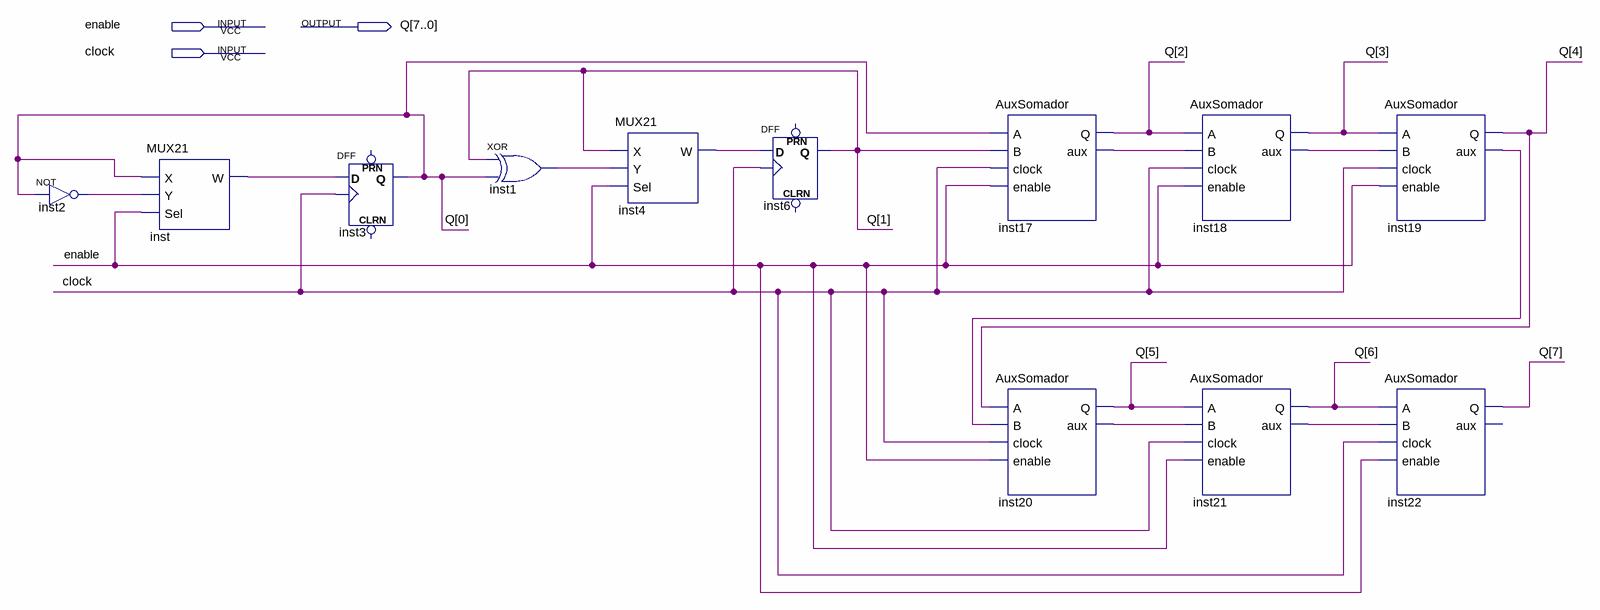
[diagram p0: schematic sheet]
// Quartus schematic Somador.bdf as structural Verilog: 12 symbols, 3 pins
module Somador (
  input  enable,
  input  clock,
  output [7:0] Q
);

  wire inst1_out, inst2_out, inst4_w, inst17_aux, inst18_aux, inst19_aux, inst20_aux, inst21_aux, inst_w;

  not inst2 (inst2_out, Q[0]);
  MUX21 inst (.X(Q[0]), .Y(inst2_out), .Sel(enable), .W(inst_w));
  DFF inst3 (.CLK(clock), .D(inst_w), .Q(Q[0]));  // open: CLRN, PRN
  xor inst1 (inst1_out, Q[1], Q[0]);
  MUX21 inst4 (.X(Q[1]), .Y(inst1_out), .Sel(enable), .W(inst4_w));
  DFF inst6 (.CLK(clock), .D(inst4_w), .Q(Q[1]));  // open: CLRN, PRN
  AuxSomador inst17 (.A(Q[0]), .B(Q[1]), .clock(clock), .enable(enable), .Q(Q[2]), .aux(inst17_aux));
  AuxSomador inst20 (.A(Q[4]), .B(inst19_aux), .clock(clock), .enable(enable), .Q(Q[5]), .aux(inst20_aux));
  AuxSomador inst18 (.A(Q[2]), .B(inst17_aux), .clock(clock), .enable(enable), .Q(Q[3]), .aux(inst18_aux));
  AuxSomador inst21 (.A(Q[5]), .B(inst20_aux), .clock(clock), .enable(enable), .Q(Q[6]), .aux(inst21_aux));
  AuxSomador inst19 (.A(Q[3]), .B(inst18_aux), .clock(clock), .enable(enable), .Q(Q[4]), .aux(inst19_aux));
  AuxSomador inst22 (.A(Q[6]), .B(inst21_aux), .clock(clock), .enable(enable), .Q(Q[7]));  // open: aux
endmodule
